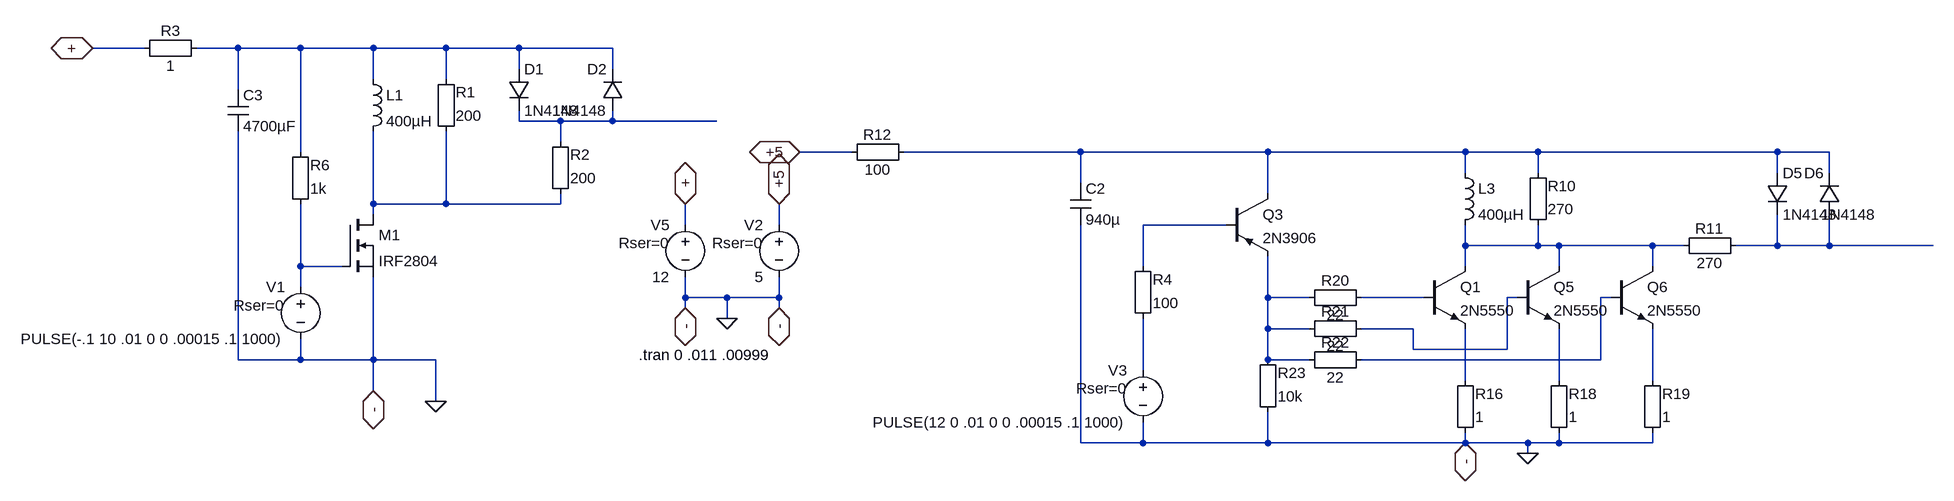
[diagram p0: schematic meat_haw_5.asc]
meat_haw_5.asc, the LTspice schematic file:
Version 4
SHEET 1 4676 1612
WIRE -112 -2400 -192 -2400
WIRE 32 -2400 -32 -2400
WIRE 128 -2400 32 -2400
WIRE 240 -2400 128 -2400
WIRE 352 -2400 240 -2400
WIRE 464 -2400 352 -2400
WIRE 608 -2400 464 -2400
WIRE 464 -2368 464 -2400
WIRE 608 -2368 608 -2400
WIRE 240 -2352 240 -2400
WIRE 352 -2352 352 -2400
WIRE 32 -2336 32 -2400
WIRE 464 -2288 464 -2304
WIRE 528 -2288 464 -2288
WIRE 608 -2288 608 -2304
WIRE 608 -2288 528 -2288
WIRE 768 -2288 608 -2288
WIRE 528 -2256 528 -2288
WIRE 128 -2240 128 -2400
WIRE 976 -2240 896 -2240
WIRE 1328 -2240 1056 -2240
WIRE 1616 -2240 1328 -2240
WIRE 1920 -2240 1616 -2240
WIRE 2032 -2240 1920 -2240
WIRE 2400 -2240 2032 -2240
WIRE 2480 -2240 2400 -2240
WIRE 1920 -2208 1920 -2240
WIRE 2032 -2208 2032 -2240
WIRE 2400 -2208 2400 -2240
WIRE 2480 -2208 2480 -2240
WIRE 1328 -2192 1328 -2240
WIRE 1616 -2176 1616 -2240
WIRE 240 -2160 240 -2272
WIRE 352 -2160 352 -2272
WIRE 352 -2160 240 -2160
WIRE 528 -2160 528 -2176
WIRE 528 -2160 352 -2160
WIRE 240 -2144 240 -2160
WIRE 720 -2128 720 -2160
WIRE 864 -2128 864 -2160
WIRE 1552 -2128 1424 -2128
WIRE 1920 -2096 1920 -2128
WIRE 2032 -2096 2032 -2128
WIRE 2032 -2096 1920 -2096
WIRE 2064 -2096 2032 -2096
WIRE 2208 -2096 2064 -2096
WIRE 2256 -2096 2208 -2096
WIRE 2400 -2096 2400 -2144
WIRE 2400 -2096 2336 -2096
WIRE 2480 -2096 2480 -2144
WIRE 2480 -2096 2400 -2096
WIRE 2640 -2096 2480 -2096
WIRE 128 -2064 128 -2160
WIRE 192 -2064 128 -2064
WIRE 1424 -2064 1424 -2128
WIRE 1920 -2064 1920 -2096
WIRE 2064 -2064 2064 -2096
WIRE 2208 -2064 2208 -2096
WIRE 128 -2032 128 -2064
WIRE 720 -2016 720 -2048
WIRE 784 -2016 720 -2016
WIRE 864 -2016 864 -2048
WIRE 864 -2016 784 -2016
WIRE 1616 -2016 1616 -2080
WIRE 1680 -2016 1616 -2016
WIRE 1856 -2016 1760 -2016
WIRE 2000 -2016 1984 -2016
WIRE 2144 -2016 2128 -2016
WIRE 720 -2000 720 -2016
WIRE 864 -2000 864 -2016
WIRE 784 -1984 784 -2016
WIRE 1616 -1968 1616 -2016
WIRE 1680 -1968 1616 -1968
WIRE 1840 -1968 1760 -1968
WIRE 1840 -1936 1840 -1968
WIRE 1984 -1936 1984 -2016
WIRE 1984 -1936 1840 -1936
WIRE 32 -1920 32 -2272
WIRE 128 -1920 128 -1952
WIRE 128 -1920 32 -1920
WIRE 240 -1920 240 -2048
WIRE 240 -1920 128 -1920
WIRE 336 -1920 240 -1920
WIRE 1616 -1920 1616 -1968
WIRE 1680 -1920 1616 -1920
WIRE 2128 -1920 2128 -2016
WIRE 2128 -1920 1760 -1920
WIRE 1424 -1904 1424 -1984
WIRE 1920 -1888 1920 -1968
WIRE 2064 -1888 2064 -1968
WIRE 2208 -1888 2208 -1968
WIRE 240 -1872 240 -1920
WIRE 336 -1856 336 -1920
WIRE 1328 -1792 1328 -2128
WIRE 1424 -1792 1424 -1824
WIRE 1424 -1792 1328 -1792
WIRE 1616 -1792 1616 -1840
WIRE 1616 -1792 1424 -1792
WIRE 1920 -1792 1920 -1808
WIRE 1920 -1792 1616 -1792
WIRE 2016 -1792 1920 -1792
WIRE 2064 -1792 2064 -1808
WIRE 2064 -1792 2016 -1792
WIRE 2208 -1792 2208 -1808
WIRE 2208 -1792 2064 -1792
WIRE 2016 -1776 2016 -1792
FLAG 720 -2160 +
IOPIN 720 -2160 BiDir
FLAG 720 -2000 -
IOPIN 720 -2000 BiDir
FLAG 240 -1872 -
IOPIN 240 -1872 BiDir
FLAG -192 -2400 +
IOPIN -192 -2400 BiDir
FLAG 336 -1856 0
FLAG 1920 -1792 -
IOPIN 1920 -1792 BiDir
FLAG 896 -2240 +5
IOPIN 896 -2240 BiDir
FLAG 2016 -1776 0
FLAG 864 -2160 +5
IOPIN 864 -2160 BiDir
FLAG 864 -2000 -
IOPIN 864 -2000 BiDir
FLAG 784 -1984 0
SYMBOL voltage 720 -2144 M0
WINDOW 123 0 0 Left 2
WINDOW 39 24 44 Left 2
SYMATTR SpiceLine Rser=0
SYMATTR InstName V5
SYMATTR Value 12
SYMBOL Misc\\EuropeanCap 16 -2336 R0
SYMATTR InstName C3
SYMATTR Value 4700µF
SYMATTR SpiceLine V=400 Irms=1 Rser=.32 Lser=0
SYMBOL ind 224 -2368 R0
SYMATTR InstName L1
SYMATTR Value 400µH
SYMBOL Misc\\EuropeanResistor 336 -2256 M180
WINDOW 0 31 76 Left 2
WINDOW 3 31 40 Left 2
SYMATTR InstName R1
SYMATTR Value 200
SYMBOL Misc\\EuropeanResistor 512 -2160 M180
WINDOW 0 31 76 Left 2
WINDOW 3 31 40 Left 2
SYMATTR InstName R2
SYMATTR Value 200
SYMBOL diode 448 -2368 R0
SYMATTR InstName D1
SYMATTR Value 1N4148
SYMBOL diode 624 -2304 R180
WINDOW 0 24 64 Left 2
WINDOW 3 24 0 Left 2
SYMATTR InstName D2
SYMATTR Value 1N4148
SYMBOL Misc\\EuropeanResistor -128 -2416 M90
WINDOW 0 5 56 VBottom 2
WINDOW 3 27 56 VTop 2
SYMATTR InstName R3
SYMATTR Value 1
SYMBOL nmos 192 -2144 R0
SYMATTR InstName M1
SYMATTR Value IRF2804
SYMBOL voltage 128 -2048 M0
WINDOW 123 0 0 Left 2
WINDOW 39 24 44 Left 2
SYMATTR SpiceLine Rser=0
SYMATTR InstName V1
SYMATTR Value PULSE(-.1 10 .01 0 0 .00015 .1 1000)
SYMBOL Misc\\EuropeanResistor 112 -2144 M180
WINDOW 0 31 76 Left 2
WINDOW 3 31 40 Left 2
SYMATTR InstName R6
SYMATTR Value 1k
SYMBOL Misc\\EuropeanCap 1312 -2192 R0
SYMATTR InstName C2
SYMATTR Value 940µ
SYMATTR SpiceLine V=400 Irms=1 Rser=.32 Lser=0
SYMBOL ind 1904 -2224 R0
SYMATTR InstName L3
SYMATTR Value 400µH
SYMATTR SpiceLine Rser=.7
SYMBOL Misc\\EuropeanResistor 2016 -2112 M180
WINDOW 0 31 76 Left 2
WINDOW 3 31 40 Left 2
SYMATTR InstName R10
SYMATTR Value 270
SYMBOL Misc\\EuropeanResistor 2240 -2112 M90
WINDOW 0 5 56 VBottom 2
WINDOW 3 27 56 VTop 2
SYMATTR InstName R11
SYMATTR Value 270
SYMBOL diode 2384 -2208 R0
SYMATTR InstName D5
SYMATTR Value 1N4148
SYMBOL diode 2496 -2144 R180
WINDOW 0 24 64 Left 2
WINDOW 3 -56 0 Left 2
SYMATTR InstName D6
SYMATTR Value 1N4148
SYMBOL Misc\\EuropeanResistor 960 -2256 M90
WINDOW 0 5 56 VBottom 2
WINDOW 3 27 56 VTop 2
SYMATTR InstName R12
SYMATTR Value 100
SYMBOL npn3 1856 -2064 R0
SYMATTR InstName Q1
SYMATTR Value 2N5550
SYMBOL Misc\\EuropeanResistor 1904 -1792 M180
WINDOW 0 31 76 Left 2
WINDOW 3 31 40 Left 2
SYMATTR InstName R16
SYMATTR Value 1
SYMBOL pnp2 1552 -2176 R0
SYMATTR InstName Q3
SYMATTR Value 2N3906
SYMBOL npn3 2000 -2064 R0
SYMATTR InstName Q5
SYMATTR Value 2N5550
SYMBOL Misc\\EuropeanResistor 2048 -1792 M180
WINDOW 0 31 76 Left 2
WINDOW 3 31 40 Left 2
SYMATTR InstName R18
SYMATTR Value 1
SYMBOL npn3 2144 -2064 R0
SYMATTR InstName Q6
SYMATTR Value 2N5550
SYMBOL Misc\\EuropeanResistor 2192 -1792 M180
WINDOW 0 31 76 Left 2
WINDOW 3 31 40 Left 2
SYMATTR InstName R19
SYMATTR Value 1
SYMBOL Misc\\EuropeanResistor 1664 -2032 M90
WINDOW 0 5 56 VBottom 2
WINDOW 3 27 56 VTop 2
SYMATTR InstName R20
SYMATTR Value 22
SYMBOL Misc\\EuropeanResistor 1664 -1984 M90
WINDOW 0 5 56 VBottom 2
WINDOW 3 27 56 VTop 2
SYMATTR InstName R21
SYMATTR Value 22
SYMBOL Misc\\EuropeanResistor 1664 -1936 M90
WINDOW 0 5 56 VBottom 2
WINDOW 3 27 56 VTop 2
SYMATTR InstName R22
SYMATTR Value 22
SYMBOL Misc\\EuropeanResistor 1600 -1824 M180
WINDOW 0 31 76 Left 2
WINDOW 3 31 40 Left 2
SYMATTR InstName R23
SYMATTR Value 10k
SYMBOL voltage 1424 -1920 M0
WINDOW 123 0 0 Left 2
WINDOW 39 24 44 Left 2
SYMATTR SpiceLine Rser=0
SYMATTR InstName V3
SYMATTR Value PULSE(12 0 .01 0 0 .00015 .1 1000)
SYMBOL Misc\\EuropeanResistor 1408 -1968 M180
WINDOW 0 31 76 Left 2
WINDOW 3 31 40 Left 2
SYMATTR InstName R4
SYMATTR Value 100
SYMBOL voltage 864 -2144 M0
WINDOW 123 0 0 Left 2
WINDOW 39 24 44 Left 2
SYMATTR SpiceLine Rser=0
SYMATTR InstName V2
SYMATTR Value 5
TEXT 648 -1928 Left 2 !.tran 0 .011 .00999

The netlist it stands for:
* meat_haw_5.asc
V5 + 0 12 Rser=0
C3 N001 0 4700µF V=400 Irms=1 Rser=.32 Lser=0
L1 N001 N004 400µH
R1 N004 N001 200
R2 N004 N002 200
D1 N001 N002 1N4148
D2 N002 N001 1N4148
R3 + N001 1
M1 N004 N008 0 0 IRF2804
V1 N008 0 PULSE(-.1 10 .01 0 0 .00015 .1 1000) Rser=0
R6 N008 N001 1k
C2 N003 0 940µ V=400 Irms=1 Rser=.32 Lser=0
L3 N003 N006 400µH Rser=.7
R10 N006 N003 270
R11 N006 N007 270
D5 N003 N007 1N4148
D6 N007 N003 1N4148
R12 +5 N003 100
Q1 N006 N010 N014 0 2N5550
R16 0 N014 1
Q3 N003 N005 N009 0 2N3906
Q5 N006 N011 N015 0 2N5550
R18 0 N015 1
Q6 N006 N012 N016 0 2N5550
R19 0 N016 1
R20 N009 N010 22
R21 N009 N011 22
R22 N009 N012 22
R23 0 N009 10k
V3 N013 0 PULSE(12 0 .01 0 0 .00015 .1 1000) Rser=0
R4 N013 N005 100
V2 +5 0 5 Rser=0
.model D D
.lib standard.dio
.model NPN NPN
.model PNP PNP
.lib standard.bjt
.model NMOS NMOS
.model PMOS PMOS
.lib standard.mos
.tran 0 .011 .00999
.backanno
.end